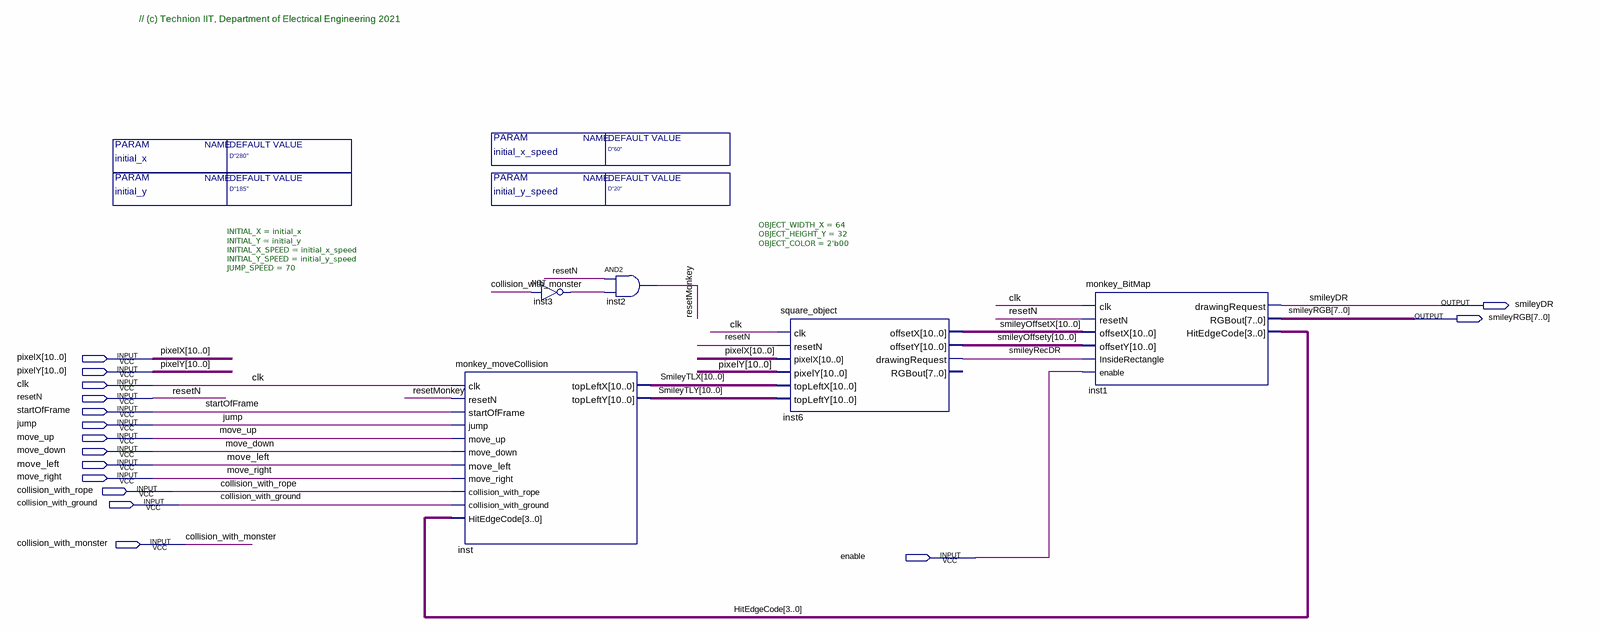
[diagram p0: schematic sheet]
// Quartus schematic monkeyBlock.bdf as structural Verilog: 5 symbols, 16 pins
module monkeyBlock #(parameter initial_x = "D\"280\"", parameter initial_y = "D\"185\"", parameter initial_x_speed = "D\"60\"", parameter initial_y_speed = "D\"20\"") (
  input  [10:0] pixelX,
  input  [10:0] pixelY,
  input  clk,
  input  resetN,
  input  startOfFrame,
  input  jump,
  input  move_up,
  input  move_down,
  input  move_left,
  input  move_right,
  input  collision_with_rope,
  input  collision_with_ground,
  input  collision_with_monster,
  input  enable,
  output smileyDR,
  output [7:0] smileyRGB
);

  wire inst3_out, resetMonkey, smileyRecDR;
  wire [3:0] HitEdgeCode;
  wire [10:0] smileyOffsetX, smileyOffsety, SmileyTLX, SmileyTLY;

  monkey_moveCollision #(.INITIAL_X(initial_x), .INITIAL_Y(initial_y), .INITIAL_X_SPEED(initial_x_speed), .INITIAL_Y_SPEED(initial_y_speed), .JUMP_SPEED(70)) inst (
    .clk(clk), .resetN(resetMonkey), .startOfFrame(startOfFrame), .jump(jump), .move_up(move_up),
    .move_down(move_down), .move_left(move_left), .move_right(move_right),
    .collision_with_rope(collision_with_rope), .collision_with_ground(collision_with_ground),
    .HitEdgeCode(HitEdgeCode), .topLeftX(SmileyTLX), .topLeftY(SmileyTLY));
  not inst3 (inst3_out, collision_with_monster);
  and inst2 (resetMonkey, resetN, inst3_out);
  square_object #(.OBJECT_WIDTH_X(64), .OBJECT_HEIGHT_Y(32), .OBJECT_COLOR(2'b00)) inst6 (
    .clk(clk), .resetN(resetN), .pixelX(pixelX), .pixelY(pixelY), .topLeftX(SmileyTLX), .topLeftY(SmileyTLY),
    .offsetX(smileyOffsetX), .offsetY(smileyOffsety), .drawingRequest(smileyRecDR));  // open: RGBout
  monkey_BitMap inst1 (
    .clk(clk), .resetN(resetN), .offsetX(smileyOffsetX), .offsetY(smileyOffsety),
    .InsideRectangle(smileyRecDR), .enable(enable), .drawingRequest(smileyDR), .RGBout(smileyRGB),
    .HitEdgeCode(HitEdgeCode));

  // Notes on the sheet:
  //   // (c) Technion IIT, Department of Electrical Engineering 2021
endmodule
